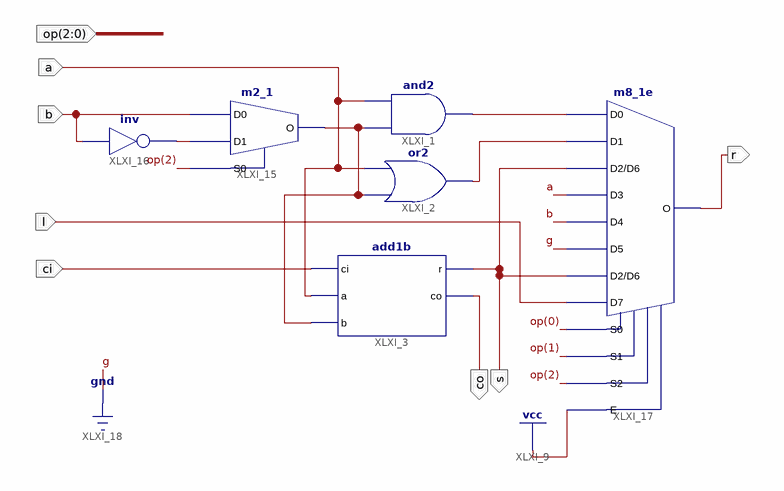
[diagram p0: schematic sheet 1]
// Xilinx ISE schematic alu1b.sch (spartan3e) as structural Verilog: 6 symbols, 8 ports
module alu1b (
  input  a,
  input  ci,
  input  l,
  input  [2:0] op,
  input  b,
  output r,
  output co,
  output s
);

  wire XLXN_8, XLXN_9, XLXN_38, XLXN_40;

  and XLXI_1 (XLXN_8, XLXN_40, a);
  or XLXI_2 (XLXN_9, XLXN_40, a);
  add1b XLXI_3 (.ci(ci), .b(XLXN_40), .a(a), .co(co), .r(s));
  m2_1 XLXI_15 (.D0(b), .D1(XLXN_38), .S0(op[2]), .O(XLXN_40));
  not XLXI_16 (XLXN_38, b);
  m8_1e XLXI_17 (
    .D0(XLXN_8), .D1(XLXN_9), .D2(s), .D3(a), .D4(b), .D5(1'b0), .D6(s), .D7(l), .E(1'b1), .S0(op[0]),
    .S1(op[1]), .S2(op[2]), .O(r));
endmodule
